# Altium schematic sheet power.SchDoc
size A4
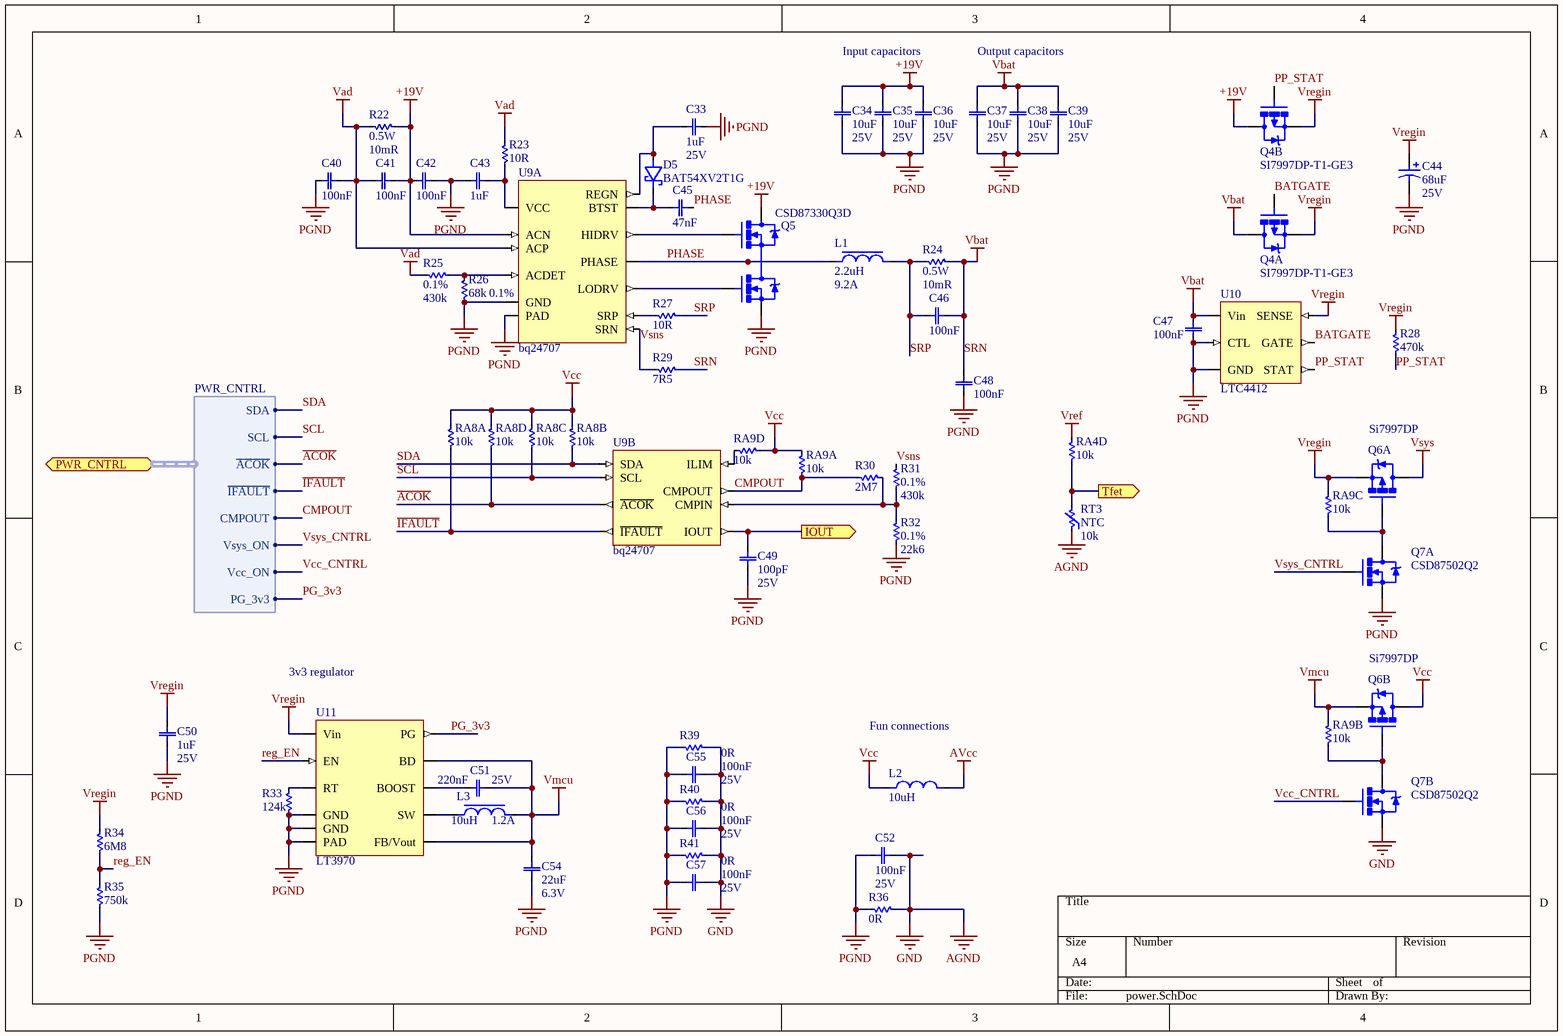
[diagram p0: power.SchDoc]

## Parts
C33  Capacitance: 1uF  [CAP0603]  (hidden comment: 25V)
C34  Capacitance: 10uF  Voltage: 25V  [CAP1206]
C35  Capacitance: 10uF  Voltage: 25V  [CAP1206]
C36  Capacitance: 10uF  Voltage: 25V  [CAP1206]
C37  Capacitance: 10uF  Voltage: 25V  [CAP1206]
C38  Capacitance: 10uF  Voltage: 25V  [CAP1206]
C39  Capacitance: 10uF  Voltage: 25V  [CAP1206]
C40  Capacitance: 100nF  [CAP0402]  (hidden comment: 0nF)
C41  Capacitance: 100nF  [CAP0402]  (hidden comment: 0nF)
C42  Capacitance: 100nF  [CAP0402]  (hidden comment: 0nF)
C43  1uF  [CAP0603]
C44  Capacitance: 68uF  Voltage: 25V  [CAPAE6253X61L]  (hidden comment: cap_pol)
C45  Capacitance: 47nF  [CAP0402]
C46  Capacitance: 100nF  [CAP0402]  (hidden comment: 0nF)
C47  Capacitance: 100nF  [CAP0402]  (hidden comment: 0nF)
C48  Capacitance: 100nF  [CAP0402]  (hidden comment: 0nF)
C49  Capacitance: 100pF  [CAP0402]  (hidden comment: 25V)
C50  Capacitance: 1uF  [CAP0603]  (hidden comment: 25V)
C51  Capacitance: 220nF  [CAP0402]  (hidden comment: 25V)
C52  Capacitance: 100nF  [CAP0402]  (hidden comment: 25V)
C54  Capacitance: 22uF  Voltage: 6.3V  [CAP0805]
C55  Capacitance: 100nF  [CAP0402]  (hidden comment: 25V)
C56  Capacitance: 100nF  [CAP0402]  (hidden comment: 25V)
C57  Capacitance: 100nF  [CAP0402]  (hidden comment: 25V)
D5  BAT54XV2T1G  [SOD523]
L1  Inductance: 2.2uH  Saturation current: 9.2A  [XAL5030-222MEC]  (hidden comment: XAL5030-222MEC)
L2  Inductance: 10uH  [INDC0603]  (hidden comment: chip_inductor)
L3  Inductance: 10uH  Saturation current: 1.2A  [LPS4018]  (hidden comment: LPS4018-333MR)
Q4  SI7997DP-T1-GE3  [PowerPAK SO-8 DUAL]  (parts A,B of 2)
Q5  CSD87330Q3D  [TI_Q3D]
Q6  Si7997DP  [PowerPAK SO-8 DUAL]  (parts A,B of 2)
Q7  CSD87502Q2  [SON65P200X80_HS-7L_DUALFET]  (parts A,B of 2)
R22  Power: 0.5W  Resistance: 10mR  [RES0805]  (hidden comment: 0R)
R23  Resistance: 10R  [RES0603]  (hidden comment: 0R)
R24  Power: 0.5W  Resistance: 10mR  [RES0805]  (hidden comment: 0R)
R25  Tolerance: 0.1%  Resistance: 430k  [RES0402]  (hidden comment: resistor)
R26  Tolerance: 0.1%  Resistance: 68k  [RES0402]  (hidden comment: 0R)
R27  Resistance: 10R  [RES0402]  (hidden comment: resistor)
R28  Resistance: 470k  [RES0402]  (hidden comment: resistor)
R29  Resistance: 7R5  [RES0402]  (hidden comment: resistor)
R30  Resistance: 2M7  [RES0402]  (hidden comment: resistor)
R31  Tolerance: 0.1%  Resistance: 430k  [RES0402]  (hidden comment: resistor)
R32  Tolerance: 0.1%  Resistance: 22k6  [RES0402]  (hidden comment: resistor)
R33  Resistance: 124k  [RES0402]  (hidden comment: resistor)
R34  Resistance: 6M8  [RES0402]  (hidden comment: resistor)
R35  Resistance: 750k  [RES0402]  (hidden comment: resistor)
R36  Resistance: 0R  [RES0402]  (hidden comment: resistor)
R39  Resistance: 0R  [RES0402]  (hidden comment: resistor)
R40  Resistance: 0R  [RES0402]  (hidden comment: resistor)
R41  Resistance: 0R  [RES0402]  (hidden comment: resistor)
RA4  Resistance: 10k  [CAC-50P200X100-8L]  (hidden comment: quad_resistor)  (part D of 4)
RA8  10k  [CAC-50P200X100-8L]  (parts A,B,C,D of 4)
RA9  Resistance: 10k  [CAC-50P200X100-8L]  (hidden comment: quad_resistor)  (parts A,B,C,D of 4)
RT3  Type: NTC  Resistance: 10k  [RES0402]  (hidden comment: thermistor)
U9  bq24707  [QFN50P350X350X100_HS-21L]  (parts A,B of 2)
U10  LTC4412  [SOT95P280X100-6L]
U11  LT3970  [DFN50P200X300X85_HS-11L]

## Ports
IOUT (out), PWR_CNTRL (harness PWR_CNTRL), Tfet (out)

## Harnesses
PWR_CNTRL: SDA, SCL, ~{ACOK}, ~{IFAULT}, CMPOUT, Vsys_ON, Vcc_ON, PG_3v3

## Nets
+19V: C34.2 C35.2 C36.2 C41.2 C42.1 Q4.D2 Q5.D1 R22.2 U9.1(ACN)
AGND: C52.2 C55.2 C56.2 C57.2 Q7.S2 R36.1 R39.2 R40.2 R41.2 RT3.1  [also labelled GND]
AVcc: L2.2
PGND: C33.2 C34.1 C35.1 C36.1 C37.1 C38.1 C39.1 C40.1 C42.2 C43.2 C44.- C47.1 C48.1 C49.1 C50.1 C52.1 C54.2 C55.1 C56.1 C57.1 Q5.S2 Q7.S1 R26.1 R32.1 R33.2 R35.1 R36.2 R39.1 R40.1 R41.1 U9.14(GND) U9.21(PAD) U10.2(GND) U10.3(CTL) U11.4(GND) U11.5(GND) U11.11(PAD)
SRN: C37.2 C38.2 C39.2 C46.2 C47.2 C48.2 Q4.D1 R24.2 R29.2 U10.1(Vin)  [also labelled Vbat]
Vad: C40.2 C41.1 R22.1 R23.1 R25.2 U9.2(ACP)
Vcc: L2.1 Q6.D2 RA8.5 RA8.6 RA8.7 RA8.8 RA9.1 RA9.2
Vmcu: C51.2 C54.1 L3.2 Q6.S2 RA9.3 U11.1(FB/Vout) U11.8(BD)
Vref: RA4.2
Vregin: C44.+ C50.2 Q4.S1 Q4.S2 Q6.S1 R28.2 R34.2 RA9.4 U10.4(SENSE) U11.3(Vin)
Vsys: Q6.D1
~{ACOK}: RA8.2 U9.5(~{ACOK}) ; port PWR_CNTRL.~{ACOK}
BATGATE: Q4.G1 U10.5(GATE)
CMPOUT: R30.1 RA9.8 U9.3(CMPOUT) ; port PWR_CNTRL.CMPOUT
~{IFAULT}: RA8.1 U9.11(~{IFAULT}) ; port PWR_CNTRL.~{IFAULT}
IOUT: C49.2 U9.7(IOUT) ; port IOUT
PG_3v3: U11.9(PG) ; port PWR_CNTRL.PG_3v3
PHASE: C45.2 L1.1 Q5.D2 Q5.S1 U9.19(PHASE)
PP_STAT: Q4.G2 R28.1 U10.6(STAT)
reg_EN: R34.1 R35.2 U11.2(EN)
SCL: RA8.4 U9.9(SCL) ; port PWR_CNTRL.SCL
SDA: RA8.3 U9.8(SDA) ; port PWR_CNTRL.SDA
SRP: C46.1 L1.2 R24.1 R27.2
Tfet: RA4.7 RT3.2 ; port Tfet
Vcc_CNTRL: Q7.G2 ; port PWR_CNTRL.Vcc_ON
Vsns: R29.1 R31.1 U9.12(SRN)
Vsys_CNTRL: Q7.G1 ; port PWR_CNTRL.Vsys_ON
NetC33_1: C33.1 D5.A(Anode) U9.16(REGN)
NetC43_1: C43.1 R23.2 U9.20(VCC)
NetC45_1: C45.1 D5.C(Cathode) U9.17(BTST)
NetC51_1: C51.1 U11.7(BOOST)
NetL3_1: L3.1 U11.6(SW)
NetQ5_G1: Q5.G1 U9.18(HIDRV)
NetQ5_G2: Q5.G2 U9.15(LODRV)
NetQ6_G1: Q6.G1 Q7.D1 RA9.5
NetQ6_G2: Q6.G2 Q7.D2 RA9.6
NetR25_1: R25.1 R26.2 U9.6(ACDET)
NetR27_1: R27.1 U9.13(SRP)
NetR30_2: R30.2 R31.2 R32.2 U9.4(CMPIN)
NetR33_1: R33.1 U11.10(RT)
NetRA9_7: RA9.7 U9.10(ILIM)

## Notes on the sheet
- Input capacitors
- Output capacitors
- 3v3 regulator
- Fun connections

## Library data of the parts
C33-C39 C45 C49 C51 C52 C55-C57 = capacitor: Tolerance: 10%; Dielectric: X5R
  C33 C49 C51 C52 C55-C57: Voltage: 25V
C40-C42 C46-C48 = capacitor: Max voltage: 25V; Tolerance: 10%
C43 = capacitor
C44 = cap_pol: Tolerance: 20%; Type: AE
C50 = capacitor: Tolerance: 10%; Dielectric: X7R; Voltage: 25V
C54 = capacitor: Tolerance: 20%; Dielectric: X5R
D5 = Schottky diode: Peak forward current: 1A; Max forward voltage: 0.5V; Reverse voltage: 30V; Forward current: 200mA
L1 = power_inductor: RMS current: 9.7A; Tolerance: 20%; DC resistance max: 14.5mR
L2 = chip_inductor: Tolerance: 20%; DC resistance max: 1.05ohm; DC current: 250mA; Self resonant frequency: 17MHz
L3 = power_inductor: RMS current: 900mA; Tolerance: 20%; DC resistance max: 200mR
Q4 Q6 = DUAL-PFET
Q5 = BUCKFET: pin to pad: D1>Vin D2>Tgr G1>Tg G2>Bg S1>Vsw S2>Pgnd
Q7 = DUAL-NFET: PROD_ID: IC-08089
R22 R24 = resistor: Tolerance: 1%
R23 = resistor: Power: 0.125W; Tolerance: 5%
R25 R31 R32 = resistor: Power: 0.063W
R26 = resistor: Power: 0,63W
R27-R30 R33-R36 R39-R41 = resistor: Power: 0.063W; Tolerance: 1%
RA8 = quad_resistor
RT3 = thermistor: Beta: 3435K; Min temp: -40C; Max temp: 125C; Power: 60mW; Tolerance: 1%
U9 = bq24707: 1-4 Cell Li+ Battery SMBus Charge Controller With Independent Comparator and Advanced Circuit Protection
U10 = LTC4412: Low Loss PowerPath™ Controller in ThinSOT
U11 = LT3970: 40V, 350mA Step-Down Regulator with 2.5µA Quiescent Current and Integrated Diodes; Output voltage: 3.3V